# EAGLE design lvc (EAGLE 8.7.0)
DOC_NUM: 1; REVISION: A
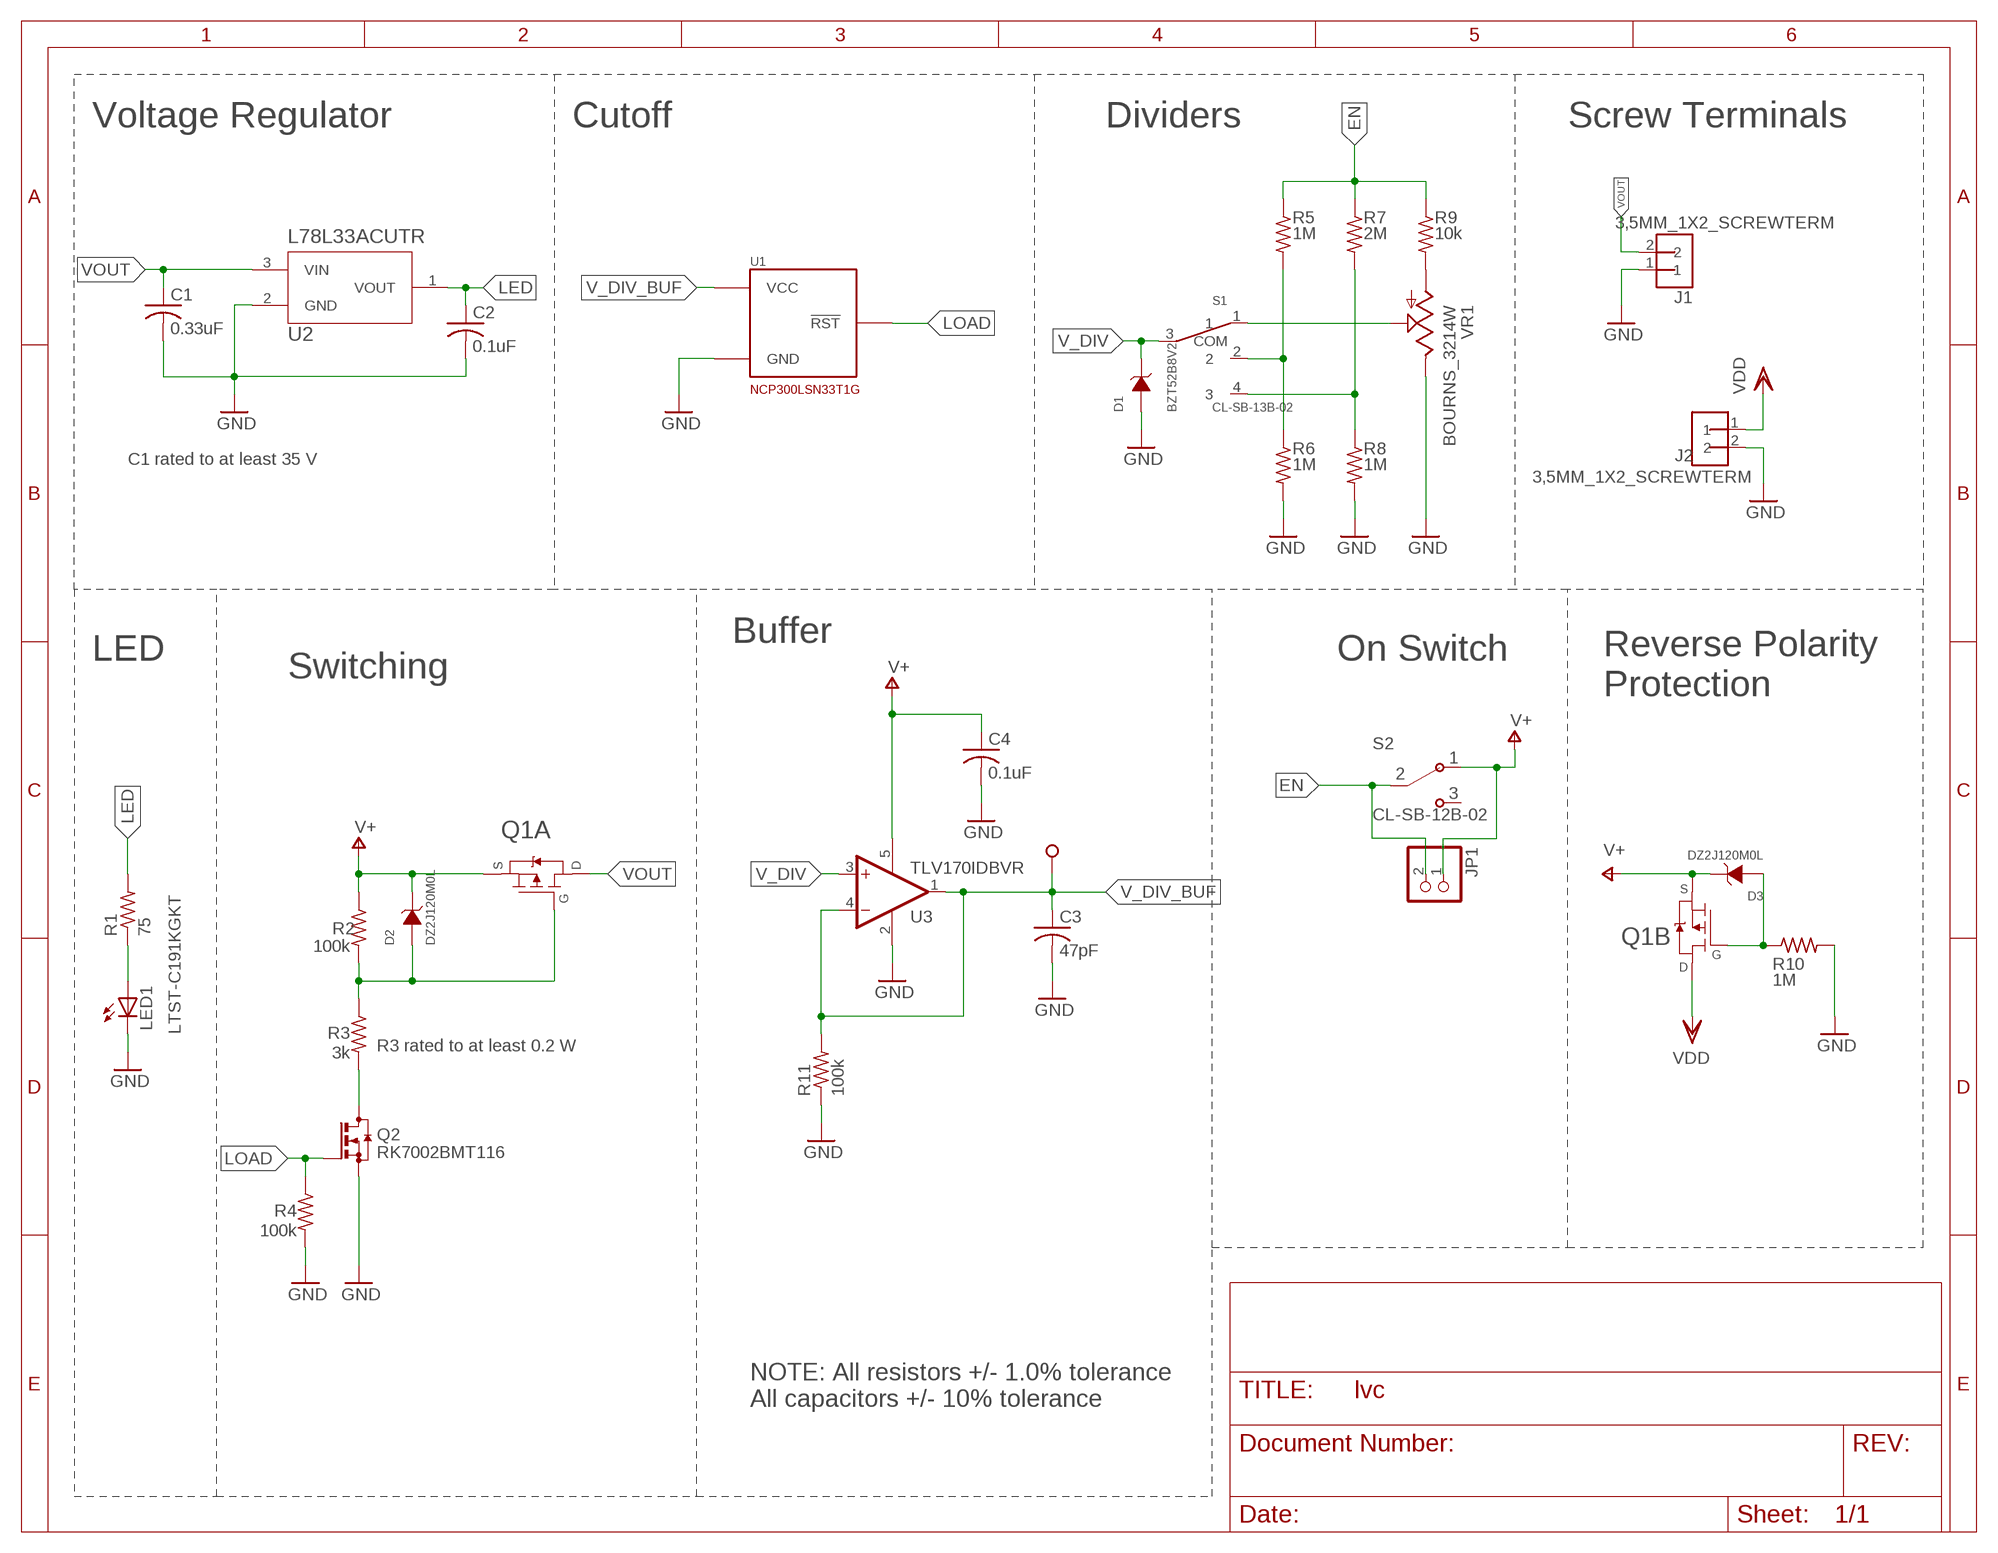
[diagram p0: schematic, sheet 1]

## Parts
C1  0.33uF  C-USC0603  [C0603]
C2  0.1uF  C-USC0603  [C0603]
C3  47pF  C-USC0603  [C0603]
C4  0.1uF  C-USC0603  [C0603]
D1  BZT52B8V2  [SOD123]
D2  DZ2J120M0L  [SMINI2-F5-B]
D3  DZ2J120M0L  [SMINI2-F5-B]
J1  3,5MM_1X2_SCREWTERM  [3.5MM_1X2]
J2  3,5MM_1X2_SCREWTERM  [3.5MM_1X2]
JP1  PINHD-1X2  [1X02]
LED1  LEDCHIPLED_0603  [CHIPLED_0603]
Q1  SI7997DP  [POWERPAK-SO-8-DUAL]
Q2  RK7002BMT116  [SOT23]
R1  75  R-US_R0603  [R0603]
R2  100k  R-US_R0603  [R0603]
R3  3k  R-US_R0603  [R0603]
R4  100k  R-US_R0603  [R0603]
R5  1M  R-US_R0603  [R0603]
R6  1M  R-US_R0603  [R0603]
R7  2M  R-US_R0603  [R0603]
R8  1M  R-US_R0603  [R0603]
R9  10k  R-US_R0603  [R0603]
R10  1M  R-US_R0603  [R0603]
R11  100k  R-US_R0603  [R0603]
S1  CL-SB-13B-02  [CL-SB-13B]
S2  CL-SB-12B-02  [CL-SB-12B]
TP2  TESTPOINTNOCREAM  [TP_2.5MM_NOCREAM]
U1  NCP300LSN33T1G  [SOT23-5]
U2  L78L33ACUTR  [SOT-89]
U3  TLV170IDBVR  [SOT23-DBV]
VR1  BOURNS_3214W  [J-LEAD_TOP_ADJ]

## Nets
2_CELL: R5.2 R6.1 S1.2
3_CELL: R7.2 R8.1 S1.4
EN: JP1.2 R5.1 R7.1 R9.1 S2.1
GND: C1.2 C2.2 C3.2 C4.2 D1.A J1.1 J2.2 LED1.C Q2.2(S) R4.2 R6.2 R8.2 R10.2 R11.1 U1.3(GND) U2.2(GND) U3.2(V-) VR1.3(E)
LED: C2.1 R1.2 U2.1(VOUT)
LOAD: Q2.1(G) R4.1 U1.1(!RST!)
N$4: LED1.A R1.1
N$5: D2.A Q1.4(A:G) R2.2 R3.1
N$6: D3.A Q1.2(B:G) R10.1
N$7: Q2.3(D) R3.2
N$8: S1.1 VR1.2(S)
N$11: R9.2 VR1.1(A)
V+: C4.1 D2.C D3.C JP1.1 Q1.1(B:S) Q1.3(A:S) R2.1 S2.2 U3.5(V+)
V_DIV: D1.C S1.3(COM) U3.3(+IN)
V_DIV_BUF: C3.1 R11.2 TP2.P$1 U1.2(VCC) U3.1(OUT) U3.4(-IN)
VDD: J2.1 Q1.7(B:D) Q1.8(B:D) Q1.8L(B:D)
VOUT: C1.1 J1.2 Q1.5(A:D) Q1.5L(A:D) Q1.6(A:D) U2.3(VIN)
Unconnected: S2.3

## Notes on the sheet
- Voltage Regulator | Cutoff | Dividers | Screw Terminals
- C1 rated to at least 35 V
- Buffer
- LED | On Switch
- Switching
- Reverse Polarity
  Protection
- LTST-C191KGKT
- R3 rated to at least 0.2 W
- NOTE: All resistors +/- 1.0% tolerance
  All capacitors +/- 10% tolerance

## Library data of the parts
C1-C4 = rcl:C-US: CAPACITOR, American symbol; SPICEPREFIX: C
D1 = vishay1:BZT52B8V2
D2 D3 = LR_zener:DZ2J120M0L; MANUFACTURER_PART_NUMBER: DZ2J120M0L; VENDOR: Panasonic
J1 J2 = NR_conn:3,5MM_1X2_SCREWTERM
JP1 = pinhead:PINHD-1X2: PIN HEADER
LED1 = led:LED: LED OSRAM: - CHIPLED LG R971, LG N971, LY N971, LG Q971, LY Q971, LO R971, LY R971 LH N974, LH R974 LS Q976, LO Q976, LY Q976 LO Q996 - Hyper CHIPLED LW Q18S LB Q993, LB Q99A, LB R99A - SideLED LS A670, LO A670, LY A670, LG A670, LP A670 LB A673, LV A673, LT A673, LW A673 LH A674 LY A675 LS A676, LA A676, LO A676, LY A676, LW A676 LS A679, LY A679, LG A679 - Hyper Micro SIDELED® LS Y876, LA Y876, LO Y876, LY Y876 LT Y87S - SmartLED LW L88C, LW L88S LB L89C, LB L89S, LG L890 LS L89K, LO L89K, LY L89K LS L896, LA L896, LO L896, LY L896 - TOPLED LS T670, LO T670, LY T670, LG T670, LP T670 LSG T670, LSP T670, LSY T670, LOP T670, LYG T670 LG T671, LOG T671, LSG T671 LB T673, LV T673, LT T673, LW T673 LH T674 LS T676, LA T676, LO T676, LY T676, LB T676, LH T676, LSB T676, LW T676 LB T67C, LV T67C, LT T67C, LS T67K, LO T67K, LY T67K, LW E67C LS E67B, LA E67B, LO E67B, LY E67B, LB E67C, LV E67C, LT E67C LW T67C LS T679, LY T679, LG T679 LS T770, LO T770, LY T770, LG T770, LP T770 LB T773, LV T773, LT T773, LW T773 LH T774 LS E675, LA E675, LY E675, LS T675 LS T776, LA T776, LO T776, LY T776, LB T776 LHGB T686 LT T68C, LB T68C - Hyper Mini TOPLED® LB M676 - Mini TOPLED Santana® LG M470 LS M47K, LO M47K, LY M47K Source: http://www.osram.convergy.de LUXEON: - LUMILED® LXK2-PW12-R00, LXK2-PW12-S00, LXK2-PW14-U00, LXK2-PW14-V00 LXK2-PM12-R00, LXK2-PM12-S00, LXK2-PM14-U00 LXK2-PE12-Q00, LXK2-PE12-R00, LXK2-PE12-S00, LXK2-PE14-T00, LXK2-PE14-U00 LXK2-PB12-K00, LXK2-PB12-L00, LXK2-PB12-M00, LXK2-PB14-N00, LXK2-PB14-P00, LXK2-PB14-Q00 LXK2-PR12-L00, LXK2-PR12-M00, LXK2-PR14-Q00, LXK2-PR14-R00 LXK2-PD12-Q00, LXK2-PD12-R00, LXK2-PD12-S00 LXK2-PH12-R00, LXK2-PH12-S00 LXK2-PL12-P00, LXK2-PL12-Q00, LXK2-PL12-R00 Source: www.luxeon.com KINGBRIGHT: KA-3528ASYC Source: www.kingbright.com
Q1 = AR_transistor:SI7997DP
Q2 = LR_transistor:RK7002BMT116
R1 R11 = rcl:R-US_: RESISTOR, American symbol; SPICEPREFIX: R
R2-R10 = resistor:R-US_: RESISTOR, American symbol
S1 = NR_switch:CL-SB-13B-02
S2 = AR_switches:CL-SB-12B-02
TP2 = CM_test:TESTPOINT
U1 = onsemi:NCP300LSN33T1G
U2 = LR_vreg:L78L33ACUTR; MANUFACTURER_PART_NUMBER: L78L33ACUTR; VENDOR: STMicroelectronics
U3 = LR_op_amps:TLV170IDBVR: TI TLV170IDBVR Op-amp
VR1 = NR_pot:BOURNS_3214W

## Board
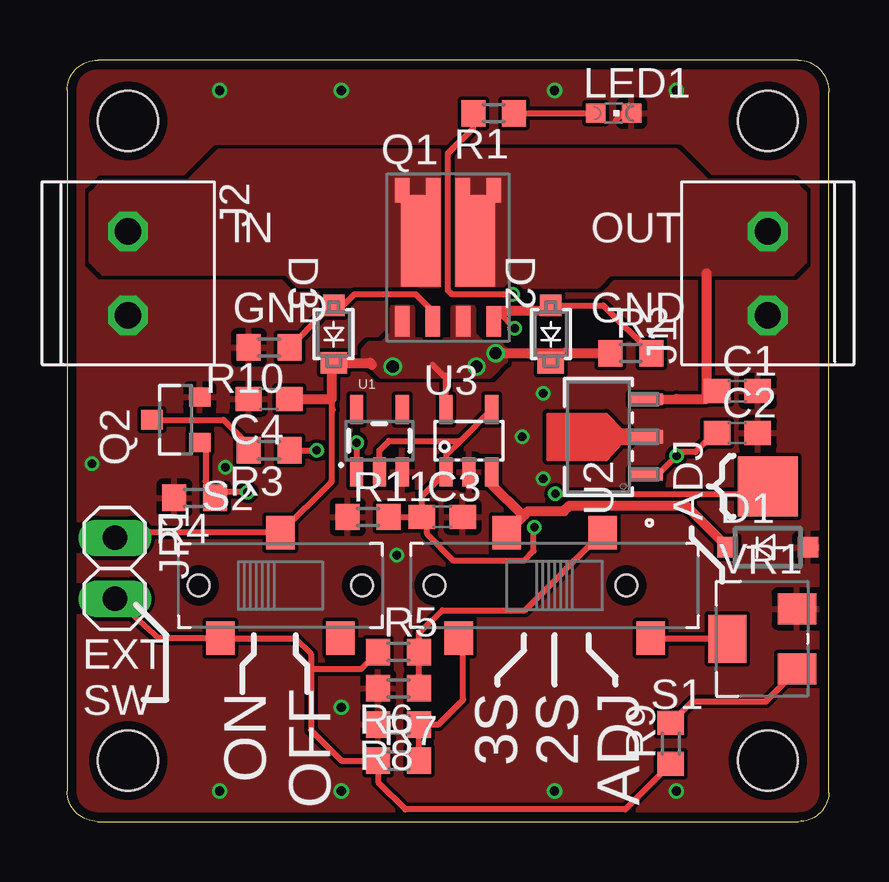
[diagram p1: board, top side]
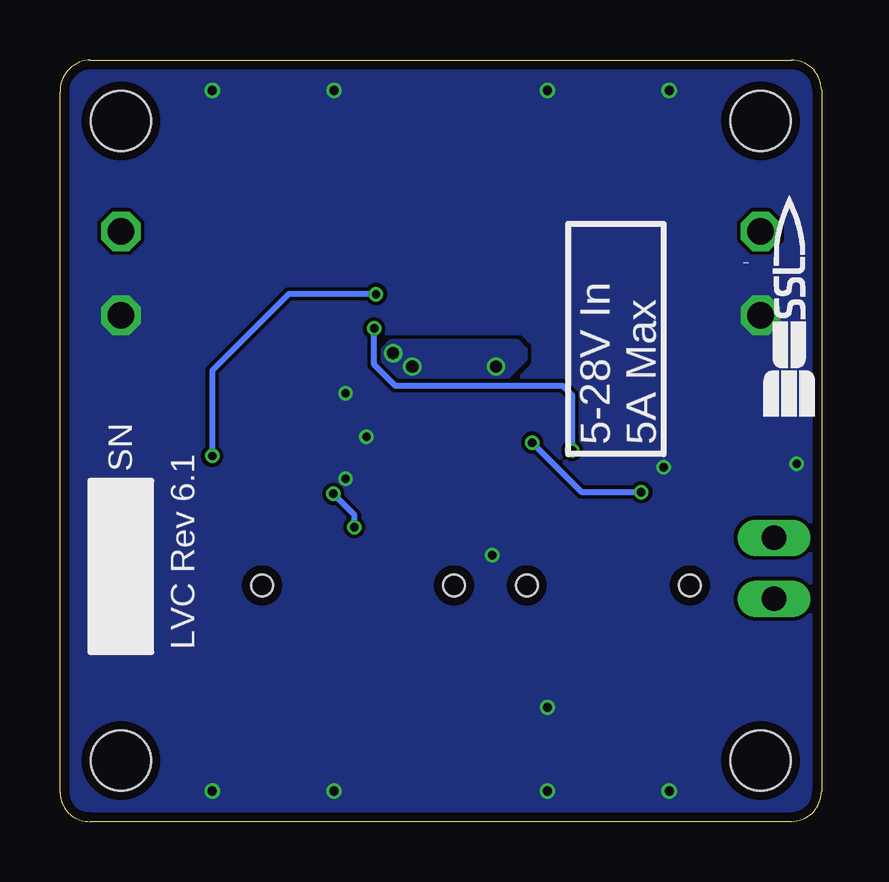
[diagram p2: board, bottom side, seen from below]

Size 31.75 x 31.75 mm. Coordinates in mm from the lower left corner, seen from the top.
Outline: 1.27,0 30.48,0 arc90 31.75,1.19 31.75,30.4 arc90 30.48,31.75 1.27,31.75 arc90 0,30.48 0,1.27 arc90 1.27,0
Copper layers (1*16): Top 0.035559375mm / dielectric 1.6mm / Bottom 0.035559375mm
Design rules "oshpark-2layer": minimum track width 6mil, minimum drill 10mil, track to track 6mil, track to pad 6mil, pad to pad 6mil, via to via 6mil, smd to smd 6mil, copper to edge 15mil, drill to drill 6mil, minimum pad ring 5mil, minimum via ring 5mil, stop-mask expansion 2.5mil, vias tented up to drill 0mil, thermal gap 10mil
Holes 2.5 mm at 2.54,29.21 29.21,29.21 29.21,2.54 2.54,2.54

### Footprints (pad centres in the part's own frame; a part is rotated, then mirrored left to right if it is on the bottom)
C0603 = smd 1.1 x 1: 1 -0.85,0; 2 0.85,0
SOD123 = smd 0.85 x 0.85: A 1.675,0; C -1.675,0
SMINI2-F5-B = smd 0.9 x 0.9: A -1.2,0 | smd 0.9 x 1.1: C 1.2,0
3.5MM_1X2 = drill 1.1 octagon: 1 -1.75,0; 2 1.75,0
1X02 = drill 1.016 long: 1 -1.27,0; 2 1.27,0
CHIPLED_0603 = smd 0.8 x 0.8: A 0,-0.75; C 0,0.75
POWERPAK-SO-8-DUAL = smd 0.61 x 1.27: 1 -1.905,-2.725; 2 -0.635,-2.725; 3 0.635,-2.725; 4 1.905,-2.725 | smd 0.61 x 1.02: 5 1.905,2.74; 8 -1.905,2.74 | smd 1.65 x 3.81: 5L 1.13,0.635; 8L -1.13,0.635 | smd 0.61 x 0.71: 6 0.61,2.895; 7 -0.61,2.895
SOT23 = smd 0.8 x 0.9: 1 -0.95,-1; 2 0.95,-1; 3 0,1
R0603 = smd 1 x 1.1: 1 -0.85,0; 2 0.85,0
CL-SB-13B = smd 1.2 x 1.4: 1 -4,2.2; 2 -2,-2.2; 3 2,-2.2; 4 4,2.2 | hole 0.9: -3,0; 5,0
CL-SB-12B = smd 1.2 x 1.4: 1 -2.5,-2.2; 2 0,2.2; 3 2.5,-2.2 | hole 0.9: -3.4,0; 3.4,0
TP_2.5MM_NOCREAM = smd 2.5 x 2.5: P$1 0,0
SOT23-5 = smd 0.55 x 1.2: 1 -0.95,-1.3; 2 0,-1.3; 3 0.95,-1.3; 4 0.95,1.3; 5 -0.95,1.3
SOT-89 = smd 0.483 x 1.397: 1 -1.57,-1.994; 3 1.57,-1.994 | smd 0.559 x 1.397: 2 0,-1.994
SOT23-DBV = smd 0.55 x 1.2: 1 -0.95,-1.3; 2 0,-1.3; 3 0.95,-1.3; 4 0.95,1.3; 5 -0.95,1.3
J-LEAD_TOP_ADJ = smd 1.6 x 1.3: 1 1.45,-1.25; 3 1.45,1.25 | smd 1.6 x 2: 2 -1.45,0

### Placement (x,y rotation side)
C1  27.94,17.94 0 top
C2  27.94,16.19 0 top
C3  15.64,12.7 0 top
C4  8.41,17.62 180 top
D1  29.21,11.43 0 top
D2  20.16,20.32 270 top
D3  11.11,20.32 270 top
J1  29.21,22.86 90 top
J2  2.54,22.86 270 top
JP1  1.98,10.56 270 top
LED1  22.78,29.53 270 top
Q1  15.88,23.57 0 top
Q2  4.52,16.75 90 top
R1  17.78,29.53 180 top
R2  23.5,19.53 0 top
R3  8.41,15.48 180 top
R4  5.32,13.49 180 top
R5  13.81,7.06 0 top
R6  13.81,5.56 180 top
R7  13.81,2.54 0 top
R8  13.81,4.05 180 top
R9  25.16,3.25 90 top
R10  8.41,19.76 180 top
R11  12.54,12.7 0 top
S1  20.32,9.84 180 top
S2  8.89,9.84 0 top
TP2  29.21,13.97 0 top
U1  13.02,15.88 0 top
U2  22.15,16.03 90 top
U3  16.75,15.88 0 top
VR1  28.97,7.62 0 top

### Tracks (layer width: path | path; a pad name or v marks a point on that pad's centre or on a via)
2_CELL
  Top 0.254: R6.1 R5.2 14.66,7.83 15.64,8.81 19.09,8.81 S1.2
3_CELL
  Top 0.254: R7.2 R8.1 15.48,4.05 16.51,5.08 16.51,7.45 S1.4
EN
  Top 0.254: 10.16,6.35 10.16,6.99 9.5,7.64 S2.1 3.81,7.64 JP1.2 | 10.16,6.35 10.16,3.81 11.43,2.54 12.7,2.54 | R5.1 12.25,6.35 10.16,6.35 | R7.1 12.96,1.64 14.1,0.51 23.27,0.51 R9.1
  Top 0.406: 12.7,2.54 R7.1 12.96,2.28
GND  (via drill 0.35, 0.38)
  Top 0.254: LED1.C 23.18,29.53 22.86,29.21 | U3.2 16.75,13.97
  other vias: 11.43,1.27 20.32,1.27 11.43,4.76 6.35,1.27 6.59,14.76 6.35,30.48 25.4,30.48 11.43,30.48 20.32,30.48 19.84,14.29 19.84,17.86 18.97,16.03 13.73,11.11 1.03,14.92 25.4,1.27
  pour Top (rank 3, no thermals): 4.32,19.37 1.27,19.37 1.27,22.35 4.32,22.35
  pour Top (rank 6): -1.27,33.02 33.02,33.02 33.02,-1.27 -1.27,-1.27
  pour Bottom (rank 6): -2.54,34.29 34.29,34.29 34.29,-2.54 -2.54,-2.54
  pour Top (rank 3, no thermals): 4.32,19.37 1.27,19.37 1.27,22.35 4.32,22.35
  pour Bottom (rank 3, no thermals): 4.32,19.37 1.27,19.37 1.27,22.35 4.32,22.35
  pour Top (rank 3, no thermals): 30.99,19.37 27.94,19.37 27.94,22.35 30.99,22.35
  pour Bottom (rank 3, no thermals): 30.99,19.37 27.94,19.37 27.94,22.35 30.99,22.35
  pour Top (rank 3, no thermals): 25.35,15.32 23.1,15.4 22.54,14.84 19.37,14.76 19.45,17.43 22.38,17.38 23.07,16.72 25.35,16.64
LED  (via drill 0.35)
  Top 0.254: 17.17,29.77 R1.2 16.93,28.92 15.88,27.86 15.88,22.15 16.03,21.99 v18.57,21.99 | v25.4,15.24 25.4,15.26 | C2.1 26.99,16.19 26.19,15.4 25.56,15.4 v25.4,15.24 | U2.1 24.62,14.46 v25.4,15.24
  Bottom 0.254: v18.57,21.99 22.23,21.99 25.4,18.81 v25.4,15.24
LOAD  (via drill 0.35)
  Top 0.254: v12.06,15.8 U1.1 | v7.51,13.73 6.41,13.73 R4.1 6.17,13.55 6.03,13.77 5.76,14.2 5.76,15.56 Q2.1
  Bottom 0.254: v12.06,15.8 10,13.73 v7.51,13.73
N$4
  Top 0.254: R1.1 LED1.A
N$5  (via drill 0.35)
  Top 0.152: 18.05,21.16 17.98,21.28
  Top 0.254: v18.65,20.56 18.05,21.16 | R3.1 v10.4,15.48 | D2.A 22.35,21.52 R2.2
  Top 0.406: Q1.4 17.98,21.28 19.84,21.28 D2.A
  Bottom 0.254: v18.65,20.56 18.65,19.05 17.78,18.18 10.79,18.18 10.4,17.78 v10.4,15.48
N$6
  Top 0.254: Q1.2 15.24,21.27 14.53,21.99 11.97,21.99 11.51,21.52 D3.A 11.02,21.52 10.78,21.28 10.62,21.12 R10.1
N$7
  Top 0.254: R3.2 7.56,15.69 6.55,16.71 6.51,16.75 Q2.3
N$8
  Top 0.254: VR1.2 24.34,7.62 S1.1
N$11
  Top 0.254: VR1.1 30.42,6.29 29.13,5 26.06,5 R9.2
V+  (via drill 0.51)
  Top 0.254: 5.56,12.04 S2.2 11.03,14.19 | 5.56,12.04 3.07,12.04 JP1.1 | 11.03,14.19 11.03,17.22 | 11.03,17.22 11.03,17.62 | 11.08,17.18 11.03,17.22 | 11.01,14.21 11.03,14.19 | 5.53,12.07 5.56,12.04 | U3.5 15.8,18.57 15.72,18.57 15.24,19.05
  Top 0.406: C4.1 11.03,17.62 11.03,19.05 11.04,19.05 D3.C 12.63,19.12 12.7,19.05 | 20.71,19.53 20.72,19.54 | v17.86,19.53 20.32,19.53 | 20.32,19.53 20.71,19.53 | 20.32,19.53 19.84,19.05 D2.C | 20.71,19.53 R2.1
  other vias: 17.07,18.97 13.57,18.97
  pour Top (no thermals): 16.11,21.43 16.91,21.43 16.91,20.32 17.3,19.92 18.02,19.92 18.26,19.68 18.26,19.21 17.62,18.57 13.1,18.57 12.38,19.29 12.38,19.68 12.62,19.92 13.18,19.92 13.57,20.32 13.57,21.43 14.37,21.43 14.37,20.08 16.11,20.08
  pour Bottom: 18.26,19.68 17.94,20 12.7,20 12.38,19.68 12.38,19.29 13.1,18.57 17.62,18.57 18.26,19.21
V_DIV
  Top 0.254: 19.6,12.95 19.61,12.94 | 17.7,14.05 U3.3
  Top 0.406: S1.3 19.01,12.74 | 19.01,12.74 19.22,12.94 19.61,12.94 20.72,12.94 20.95,13.18 25.79,13.18 D1.C | 19.01,12.74 17.7,14.05
V_DIV_BUF  (via drill 0.35)
  Top 0.254: U3.4 16.38,15.85 | 16.38,15.85 15.8,15.28 U3.1 14.79,13.56 C3.1 | U1.2 13.02,15.48 13.41,15.88 16.35,15.88 16.38,15.85 | R11.2 C3.1 | v19.48,12.27 19.45,12.24 19.45,11.27 19.05,10.87 16.11,10.87 15,11.99 15,12.48 C3.1 | v20.35,13.66 28.9,13.66 TP2.P$1
  Bottom 0.254: v19.48,12.27 19.48,12.79 v20.35,13.66
VDD
  pour Top (no thermals): 1.02,26.16 1.52,26.67 5.08,26.67 6.35,27.94 15.49,27.94 15.49,22.35 9.65,22.35 9.14,22.86 1.52,22.86 1.02,23.37
VOUT
  Top 0.254: 26.67,17.78 26.83,17.94 26.99,17.94 | 26.99,17.94 C1.1 | 26.66,17.61 26.99,17.94 | 26.66,22.85 26.67,22.86
  Top 0.406: U2.3 25.4,17.61 26.66,17.61 26.66,22.85
  pour Top (no thermals): 30.73,26.16 30.23,26.67 26.67,26.67 25.4,27.94 16.26,27.94 16.26,22.35 22.1,22.35 22.61,22.86 30.23,22.86 30.73,23.37

### Text on the board
tPlace: IN | OUT | GND | GND | ADJ | OFF | ON | 3S | 2S | ADJ | EXT / SW
bPlace: 5-28V In / 5A Max | LVC Rev 6.1 | SN
Document: 2oz Copper / FR-4 or 408 / 1.0±0.1 Via plate thickness